# Altium schematic sheet Main_5.SchDoc
size 219 x 240 mm; SheetNumber: 8; SheetTotal: 12
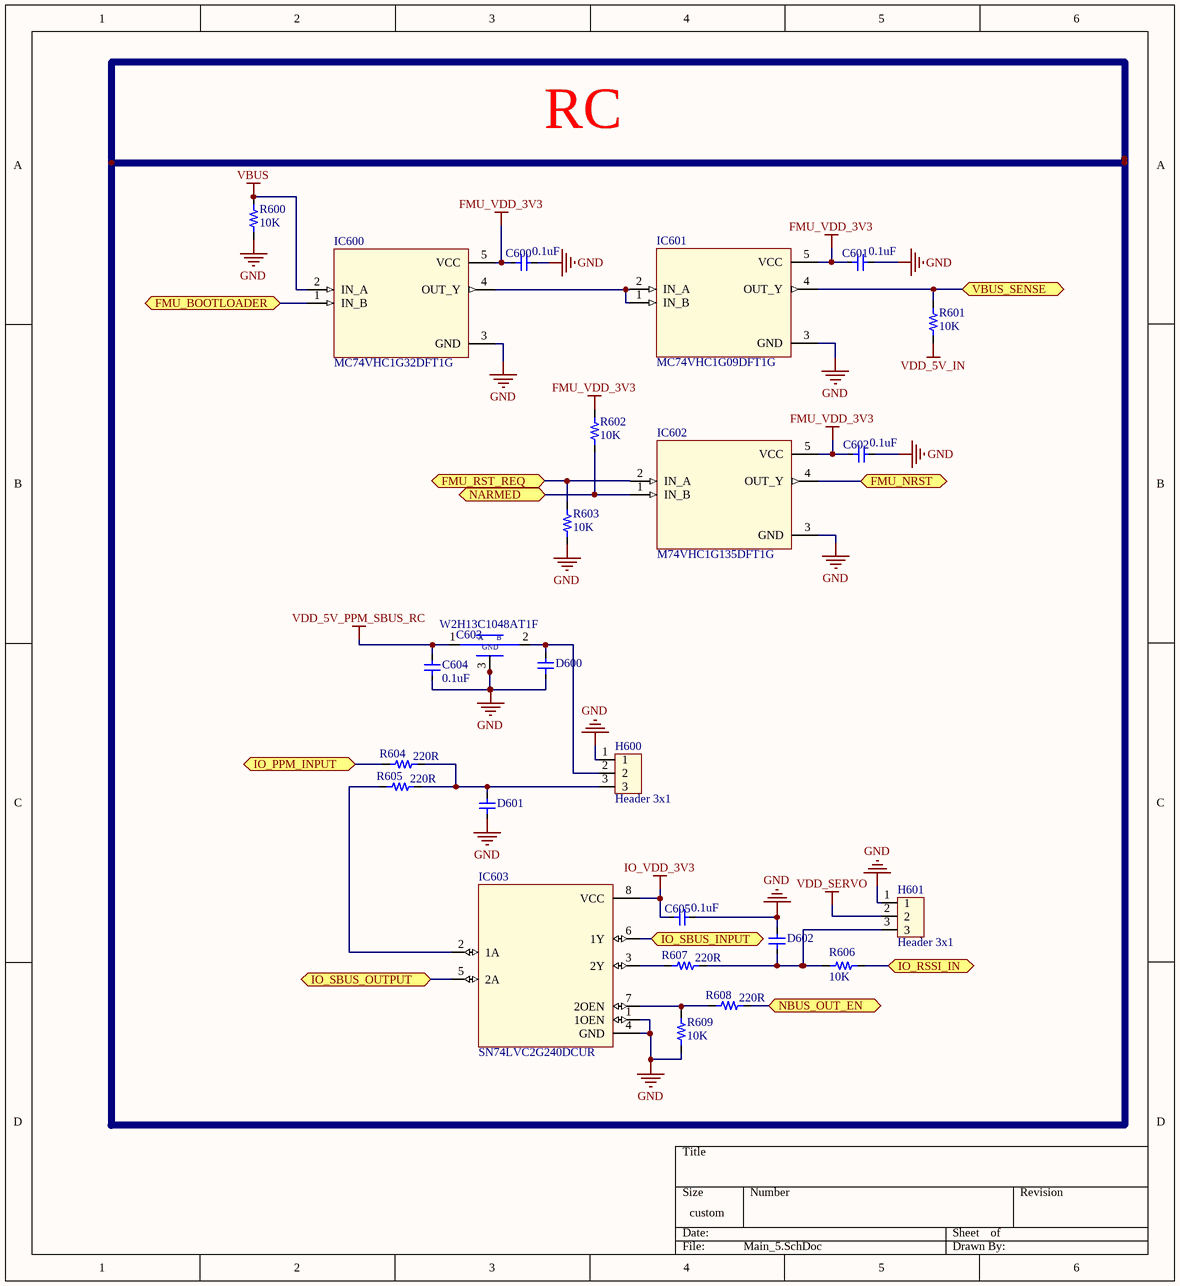
[diagram p0: Main_5.SchDoc]

## Parts
C600  0.1uF  [C0603]
C601  0.1uF  [C0603]
C602  0.1uF  [C0603]
C603  W2H13C1048AT1F  [W2H13C1048AT1F]
C604  0.1uF  [C0603]
C605  0.1uF  [C0603]
D600  PESD0402-140  [PESD0402-140]  (value not drawn)
D601  PESD0402-140  [PESD0402-140]  (value not drawn)
D602  PESD0402-140  [PESD0402-140]  (value not drawn)
H600  Header 3x1  [Header 3x1]
H601  Header 3x1  [Header 3x1]
IC600  MC74VHC1G32DFT1G  [SOT65P210X110-5N]
IC601  MC74VHC1G09DFT1G  [SOT65P210X110-5N]
IC602  M74VHC1G135DFT1G  [SOT65P210X110-5N]
IC603  SN74LVC2G240DCUR  [SN74LVC2G240DCUR]
R600  10K  [R0402]
R601  10K  [R0402]
R602  10K  [R0402]
R603  10K  [R0402]
R604  220R  [R0402]
R605  220R  [R0402]
R606  10K  [R0402]
R607  220R  [R0402]
R608  220R  [R0402]
R609  10K  [R0402]

## Ports
FMU_BOOTLOADER (bidir), FMU_NRST (bidir), FMU_RST_REQ (bidir), IO_PPM_INPUT (bidir), IO_RSSI_IN (bidir), IO_SBUS_INPUT (bidir), IO_SBUS_OUTPUT (bidir), NARMED (bidir), NBUS_OUT_EN (bidir), VBUS_SENSE (bidir)

## Nets
FMU_VDD_3V3: C600.1 C601.1 C602.1 IC600.5(VCC) IC601.5(VCC) IC602.5(VCC) R602.2
GND: C600.2 C601.2 C602.2 C603.3 C603.4 C604.1 C605.2 D600.1 D601.1 D602.2 H600.1 H601.1 IC600.3(GND) IC601.3(GND) IC602.3(GND) IC603.1(1OEN) IC603.4(GND) R600.1 R603.1 R609.1
IO_VDD_3V3: C605.1 IC603.8(VCC)
VBUS: IC600.2(IN_A) R600.2
VDD_5V_IN: R601.1
VDD_5V_PPM_SBUS_RC: C603.1 C604.2
VDD_SERVO: H601.2
FMU_BOOTLOADER: IC600.1(IN_B) ; port FMU_BOOTLOADER
FMU_NRST: IC602.4(OUT_Y) ; port FMU_NRST
FMU_RST_REQ: IC602.2(IN_A) R603.2 ; port FMU_RST_REQ
IO_PPM_INPUT: R604.1 ; port IO_PPM_INPUT
IO_RSSI_IN: R606.2 ; port IO_RSSI_IN
IO_SBUS_INPUT: IC603.6(1Y) ; port IO_SBUS_INPUT
IO_SBUS_OUTPUT: IC603.5(2A) ; port IO_SBUS_OUTPUT
NARMED: IC602.1(IN_B) R602.1 ; port NARMED
NBUS_OUT_EN: R608.2 ; port NBUS_OUT_EN
VBUS_SENSE: IC601.4(OUT_Y) R601.2 ; port VBUS_SENSE
NetC603_2: C603.2 D600.2 H600.2
NetD601_2: D601.2 H600.3 R604.2 R605.2
NetD602_1: D602.1 H601.3 R606.1 R607.2
NetIC600_4: IC600.4(OUT_Y) IC601.1(IN_B) IC601.2(IN_A)
NetIC603_2: IC603.2(1A) R605.1
NetIC603_3: IC603.3(2Y) R607.1
NetIC603_7: IC603.7(2OEN) R608.1 R609.2

## Notes on the sheet
- RC
- (in symbol W2H13C1048AT1F) A; B; GND

## Library data of the parts
C600-C602 C604 C605 = CC0603KRX7R8BB104: CAP CER 0.1UF 25V X7R 0603
C603 = W2H13C1048AT1F: Feed Through Capacitors 25V 0.1uF X7R
D600-D602 = PESD0402-140: 40V Clamp - Ipp Tvs Diode Surface Mount 0402
IC600 = MC74VHC1G32DFT1G: IC GATE OR 1CH 2-INP SC88A
IC601 = MC74VHC1G09DFT1G: IC GATE AND 1CH 2-INP SC88A
IC602 = M74VHC1G135DFT1G: Single 2-Input NAND Gate, Schmitt Trigger ,Open Drain, SC-88A / SC-70-5
IC603 = SN74LVC2G240DCUR: 2-ch, 1.65-V to 5.5-V inverters with 3-state outputs
R600-R603 R606 R609 = RC1005F103CS: RES SMD 10K OHM 1% 1/16W 0402
R604 R605 R607 R608 = RC0402FR-07220RL: RES 220 OHM 1% 1/16W 0402